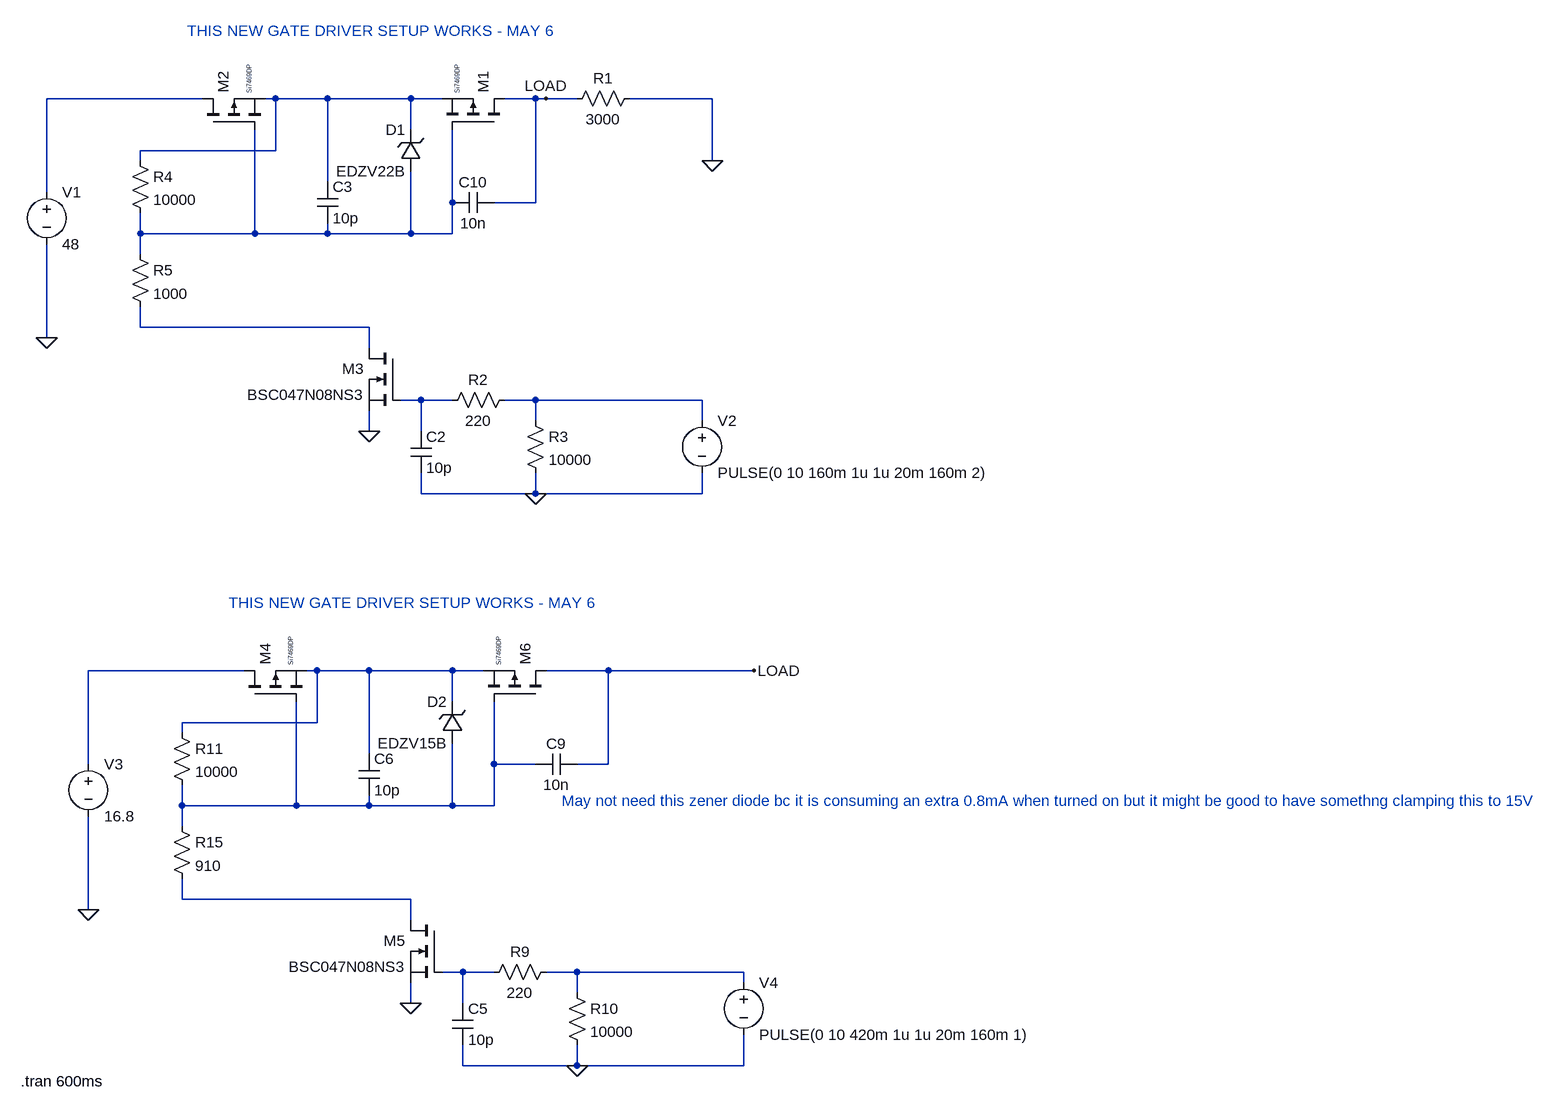
[diagram p0: schematic PMOS Bidirectional Switch Prototype 1.asc]
PMOS Bidirectional Switch Prototype 1.asc, the LTspice schematic file:
Version 4.1
SHEET 1 3412 2516
WIRE 1216 384 976 384
WIRE 1328 384 1312 384
WIRE 1408 384 1328 384
WIRE 1536 384 1408 384
WIRE 1584 384 1536 384
WIRE 1728 384 1680 384
WIRE 1744 384 1728 384
WIRE 1792 384 1744 384
WIRE 2000 384 1872 384
WIRE 1536 432 1536 384
WIRE 1328 464 1328 384
WIRE 1328 464 1120 464
WIRE 1120 480 1120 464
WIRE 2000 480 2000 384
WIRE 1408 512 1408 384
WIRE 976 528 976 384
WIRE 1600 544 1600 432
WIRE 1728 544 1728 384
WIRE 1728 544 1664 544
WIRE 1120 592 1120 560
WIRE 1296 592 1296 432
WIRE 1296 592 1120 592
WIRE 1408 592 1408 576
WIRE 1408 592 1296 592
WIRE 1536 592 1536 496
WIRE 1536 592 1408 592
WIRE 1600 592 1600 544
WIRE 1600 592 1536 592
WIRE 1120 624 1120 592
WIRE 1120 736 1120 704
WIRE 1472 736 1120 736
WIRE 976 752 976 608
WIRE 1472 768 1472 736
WIRE 1552 848 1520 848
WIRE 1600 848 1552 848
WIRE 1728 848 1680 848
WIRE 1984 848 1728 848
WIRE 1728 880 1728 848
WIRE 1984 880 1984 848
WIRE 1472 896 1472 864
WIRE 1552 896 1552 848
WIRE 1552 992 1552 960
WIRE 1728 992 1728 960
WIRE 1728 992 1552 992
WIRE 1984 992 1984 960
WIRE 1984 992 1728 992
WIRE 1280 1264 1040 1264
WIRE 1392 1264 1376 1264
WIRE 1472 1264 1392 1264
WIRE 1600 1264 1472 1264
WIRE 1648 1264 1600 1264
WIRE 1840 1264 1744 1264
WIRE 2064 1264 1840 1264
WIRE 1600 1312 1600 1264
WIRE 1392 1344 1392 1264
WIRE 1392 1344 1184 1344
WIRE 1184 1360 1184 1344
WIRE 1472 1392 1472 1264
WIRE 1040 1408 1040 1264
WIRE 1664 1408 1664 1312
WIRE 1728 1408 1664 1408
WIRE 1840 1408 1840 1264
WIRE 1840 1408 1792 1408
WIRE 1184 1472 1184 1440
WIRE 1360 1472 1360 1312
WIRE 1360 1472 1184 1472
WIRE 1472 1472 1472 1456
WIRE 1472 1472 1360 1472
WIRE 1600 1472 1600 1376
WIRE 1600 1472 1472 1472
WIRE 1664 1472 1664 1408
WIRE 1664 1472 1600 1472
WIRE 1184 1504 1184 1472
WIRE 1184 1616 1184 1584
WIRE 1536 1616 1184 1616
WIRE 1040 1632 1040 1488
WIRE 1536 1648 1536 1616
WIRE 1616 1728 1584 1728
WIRE 1664 1728 1616 1728
WIRE 1792 1728 1744 1728
WIRE 2048 1728 1792 1728
WIRE 2048 1744 2048 1728
WIRE 1792 1760 1792 1728
WIRE 1536 1776 1536 1744
WIRE 1616 1776 1616 1728
WIRE 1616 1872 1616 1840
WIRE 1792 1872 1792 1840
WIRE 1792 1872 1616 1872
WIRE 2048 1872 2048 1824
WIRE 2048 1872 1792 1872
FLAG 2000 480 0
FLAG 976 752 0
FLAG 1472 896 0
FLAG 1728 992 0
FLAG 1040 1632 0
FLAG 1536 1776 0
FLAG 1792 1872 0
FLAG 1744 384 LOAD
FLAG 2064 1264 LOAD
SYMBOL res 1888 368 R90
WINDOW 0 0 56 VBottom 2
WINDOW 3 32 56 VTop 2
SYMATTR InstName R1
SYMATTR Value 3000
SYMBOL voltage 976 512 R0
WINDOW 123 0 0 Left 0
WINDOW 39 24 124 Left 2
SYMATTR InstName V1
SYMATTR Value 48
SYMBOL nmos 1520 768 M0
SYMATTR InstName M3
SYMATTR Value BSC047N08NS3
SYMBOL voltage 1984 864 R0
WINDOW 123 0 0 Left 0
WINDOW 39 0 0 Left 0
SYMATTR InstName V2
SYMATTR Value PULSE(0 10 160m 1u 1u 20m 160m 2)
SYMBOL res 1696 832 R90
WINDOW 0 0 56 VBottom 2
WINDOW 3 32 56 VTop 2
SYMATTR InstName R2
SYMATTR Value 220
SYMBOL res 1712 864 R0
SYMATTR InstName R3
SYMATTR Value 10000
SYMBOL cap 1536 896 R0
SYMATTR InstName C2
SYMATTR Value 10p
SYMBOL res 1104 464 R0
SYMATTR InstName R4
SYMATTR Value 10000
SYMBOL res 1104 608 R0
SYMATTR InstName R5
SYMATTR Value 1000
SYMBOL cap 1392 512 R0
SYMATTR InstName C3
SYMATTR Value 10p
SYMBOL zener 1552 496 R180
WINDOW 0 24 64 Left 2
WINDOW 3 24 0 Left 2
SYMATTR InstName D1
SYMATTR Value EDZV22B
SYMBOL voltage 1040 1392 R0
WINDOW 123 0 0 Left 0
WINDOW 39 24 124 Left 2
SYMATTR InstName V3
SYMATTR Value 16.8
SYMBOL nmos 1584 1648 M0
SYMATTR InstName M5
SYMATTR Value BSC047N08NS3
SYMBOL res 1760 1712 R90
WINDOW 0 0 56 VBottom 2
WINDOW 3 32 56 VTop 2
SYMATTR InstName R9
SYMATTR Value 220
SYMBOL res 1776 1744 R0
SYMATTR InstName R10
SYMATTR Value 10000
SYMBOL cap 1600 1776 R0
SYMATTR InstName C5
SYMATTR Value 10p
SYMBOL res 1168 1344 R0
SYMATTR InstName R11
SYMATTR Value 10000
SYMBOL res 1168 1488 R0
SYMATTR InstName R15
SYMATTR Value 910
SYMBOL cap 1456 1392 R0
SYMATTR InstName C6
SYMATTR Value 10p
SYMBOL pmos 1744 1312 M270
WINDOW 3 56 72 Left 0
SYMATTR Value Si7469DP
SYMATTR InstName M6
SYMBOL zener 1616 1376 R180
WINDOW 0 24 64 Left 2
WINDOW 3 24 0 Left 2
SYMATTR InstName D2
SYMATTR Value EDZV15B
SYMBOL pmos 1280 1312 R270
WINDOW 3 56 72 Left 0
SYMATTR Value Si7469DP
SYMATTR InstName M4
SYMBOL pmos 1680 432 M270
WINDOW 3 56 72 Left 0
SYMATTR Value Si7469DP
SYMATTR InstName M1
SYMBOL pmos 1216 432 R270
WINDOW 3 56 72 Left 0
SYMATTR Value Si7469DP
SYMATTR InstName M2
SYMBOL voltage 2048 1728 R0
WINDOW 123 0 0 Left 0
WINDOW 39 0 0 Left 0
SYMATTR InstName V4
SYMATTR Value PULSE(0 10 420m 1u 1u 20m 160m 1)
SYMBOL cap 1792 1392 R90
WINDOW 0 0 32 VBottom 2
WINDOW 3 32 32 VTop 2
SYMATTR InstName C9
SYMATTR Value 10n
SYMBOL cap 1664 528 R90
WINDOW 0 0 32 VBottom 2
WINDOW 3 32 32 VTop 2
SYMATTR InstName C10
SYMATTR Value 10n
TEXT 1192 280 Left 2 ;THIS NEW GATE DRIVER SETUP WORKS - MAY 6
TEXT 1256 1160 Left 2 ;THIS NEW GATE DRIVER SETUP WORKS - MAY 6
TEXT 1768 1464 Left 2 ;May not need this zener diode bc it is consuming an extra 0.8mA when turned on but it might be good to have somethng clamping this to 15V
TEXT 936 1896 Left 2 !.tran 600ms

The netlist it stands for:
* PMOS Bidirectional Switch Prototype 1.asc
R1 0 LOAD 3000
V1 N001 0 48
M3 N004 N005 0 0 BSC047N08NS3
V2 N006 0 PULSE(0 10 160m 1u 1u 20m 160m 2)
R2 N006 N005 220
R3 N006 0 10000
C2 N005 0 10p
R4 N002 N003 10000
R5 N003 N004 1000
C3 N002 N003 10p
D1 N003 N002 EDZV22B
V3 N007 0 16.8
M5 N010 N011 0 0 BSC047N08NS3
R9 N012 N011 220
R10 N012 0 10000
C5 N011 0 10p
R11 N008 N009 10000
R15 N009 N010 910
C6 N008 N009 10p
M6 LOAD N009 N008 N008 Si7469DP
D2 N009 N008 EDZV15B
M4 N007 N009 N008 N008 Si7469DP
M1 LOAD N003 N002 N002 Si7469DP
M2 N001 N003 N002 N002 Si7469DP
V4 N012 0 PULSE(0 10 420m 1u 1u 20m 160m 1)
C9 LOAD N009 10n
C10 LOAD N003 10n
.model D D
.lib standard.dio
.model NMOS NMOS
.model PMOS PMOS
.lib standard.mos
* THIS NEW GATE DRIVER SETUP WORKS - MAY 6
* THIS NEW GATE DRIVER SETUP WORKS - MAY 6
* May not need this zener diode bc it is consuming an extra 0.8mA when turned on but it might be good to have somethng clamping this to 15V
.tran 600ms
.backanno
.end